# EasyEDA schematic SCH_DFM PCB_2023-04-27.json
TITLE: Distrubuted Fence Monitor; REV: 5.0; Date: 2023-3-20; Sheet: 1/1; Drawn By: B BRAITHWAITE; Company: ERAU ICARUS DFM CAPSTONE
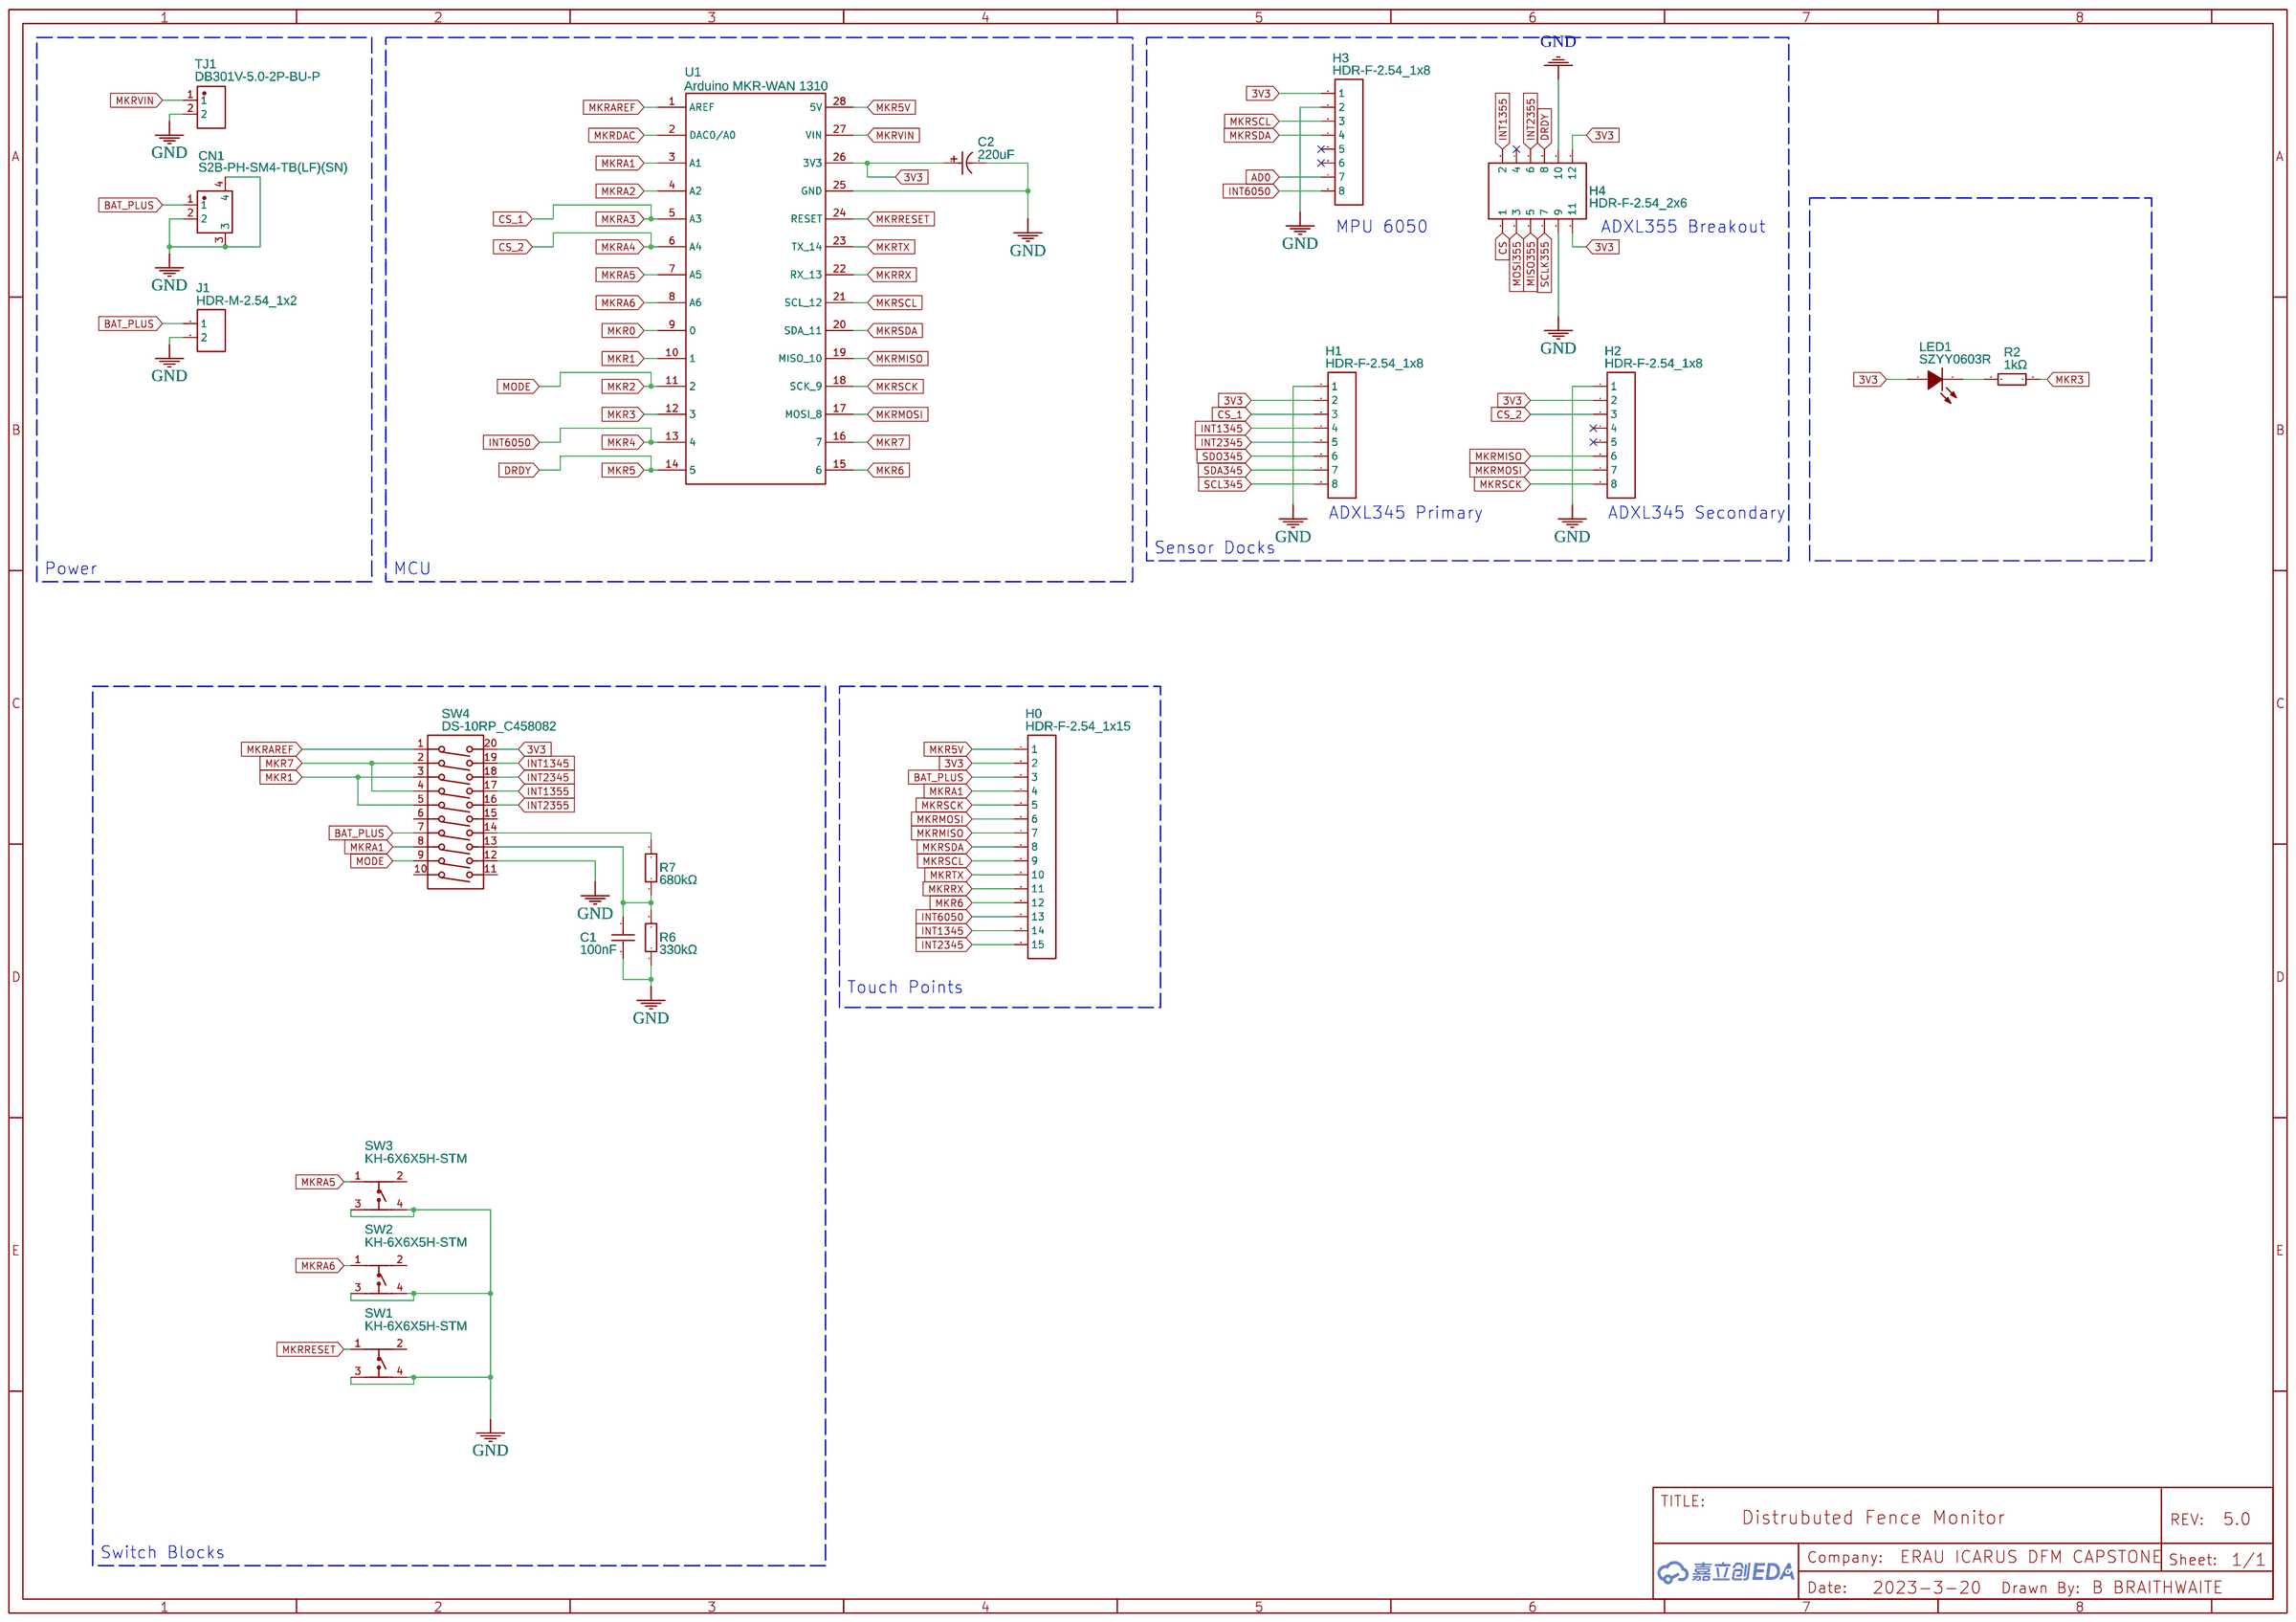
[diagram p0: schematic sheet]

## Parts
C1  100nF  [C0603]
C2  220uF  [CAP-SMD_BD6.3-L6.6-W6.6-FD]
CN1  S2B-PH-SM4-TB(LF)(SN)  [CONN-SMD_P2.00_S2B-PH-SM4-TB-LF-SN]
H0  HDR-F-2.54_1x15  [HDR-F-2.54_1X15]
H1  HDR-F-2.54_1x8  [HDR-F-2.54_1X8]
H2  HDR-F-2.54_1x8  [HDR-F-2.54_1X8]
H3  HDR-F-2.54_1x8  [HDR-F-2.54_1X8]
H4  HDR-F-2.54_2x6  [HDR-F-2.54_2X6]
J1  HDR-M-2.54_1x2  [HDR-M-2.54_1X2]
LED1  SZYY0603R  [LED0603-R-RD]
R2  1kΩ  [R0805]
R6  330kΩ  [R0805]
R7  680kΩ  [R0805]
SW1  KH-6X6X5H-STM  [SW-SMD_4P-L6.0-W6.0-P4.50-LS9.0-2]
SW2  KH-6X6X5H-STM  [SW-SMD_4P-L6.0-W6.0-P4.50-LS9.0-2]
SW3  KH-6X6X5H-STM  [SW-SMD_4P-L6.0-W6.0-P4.50-LS9.0-2]
SW4  DS-10RP_C458082  [SW-TH_DS-10RP]
TJ1  DB301V-5.0-2P-BU-P  [CONN-TH_2P-P5.00_DB301V-5.0-2P-BU-P]
U1  Arduino MKR-WAN 1310  [ARDUINO MKR1310]

## Library data of the parts
C1 = 0603B104K500NT: Supplier: LCSC; Manufacturer: FH(风华); Supplier Part: C30926; JLCPCB Part Class: Extended Part
C2 = RVT1A221M0605-C72494: Supplier: LCSC; Manufacturer: ROQANG(容强); Manufacturer Part: RVT1A221M0605; Supplier Part: C72494; JLCPCB Part Class: Extended Part
CN1 = S2B-PH-SM4-TB(LF)(SN): Supplier: LCSC; Supplier Part: C295747; Manufacturer: JST; Contributor: LCSC; JLCPCB Part Class: Extended Part
H0 = HDR-F-2.54_1x15: Supplier Part: C124408; Supplier: LCSC; Contributor: LCEDA_Lib
H1-H3 = HDR-F-2.54_1x8: Supplier Part: C225505; Supplier: LCSC; Contributor: LCEDA_Lib
H4 = HDR-F-2.54_2x6: Supplier Part: C36191; Supplier: LCSC; Contributor: LCEDA_Lib
J1 = HDR-M-2.54_1x2: Supplier Part: C124375; Supplier: LCSC; Contributor: LCEDA_Lib
LED1 = SZYY0603R: Supplier: LCSC; Supplier Part: C434419; Manufacturer: yongyu(永裕光电); Contributor: LCSC; JLCPCB Part Class: Extended Part
R2 = 0805W8F1001T5E: Supplier: LCSC; Manufacturer: UNI-ROYAL(厚声); Supplier Part: C17513; Resistance (Ohms): 1K; JLCPCB Part Class: Basic Part
R6 = 0805W8F3303T5E: Supplier: LCSC; Manufacturer: UNI-ROYAL(厚声); Supplier Part: C17629; Resistance (Ohms): 330K; JLCPCB Part Class: Basic Part
R7 = 0805W8F6803T5E: Supplier: LCSC; Manufacturer: UNI-ROYAL(厚声); Supplier Part: C17797; Resistance (Ohms): 680K; JLCPCB Part Class: Basic Part
SW1-SW3 = KH-6X6X5H-STM: Supplier: LCSC; Supplier Part: C2837531; Manufacturer: kinghelm(金航标); Contributor: LCSC; JLCPCB Part Class: Extended Part
SW4 = DS-10RP_C458082: Supplier: LCSC; Supplier Part: C458082; Manufacturer: 韩国韩荣; Manufacturer Part: DS-10RP; Contributor: LCSC; JLCPCB Part Class: Extended Part
TJ1 = DB301V-5.0-2P-BU-P: Supplier: LCSC; Supplier Part: C430621; Manufacturer: DIBO; Contributor: LCSC; JLCPCB Part Class: Extended Part
U1 = Arduino MKR-WAN 1310: Manufacturer Part: Arduino MKR GSM 1400; link: https://store.arduino.cc/mkr-wan-1310; Contributor: rafaellabastos

## Nets
3V3: C2.1 H0.2 H1.2 H2.2 H3.1 H4.11 H4.12 LED1.1(+) SW4.20 U1.26(3V3)
GND: C1.1 C2.2 CN1.2 CN1.3 CN1.4 H1.1 H2.1 H3.2 H4.9 H4.10 J1.2 R6.1 SW1.3 SW1.4 SW2.3 SW2.4 SW3.3 SW3.4 SW4.12 TJ1.2 U1.25(GND)
AD0: H3.7
BAT_PLUS: CN1.1 H0.3 J1.1 SW4.7
CS: H4.1
CS_1: H1.3 U1.5(A3)
CS_2: H2.3 U1.6(A4)
DRDY: H4.8 U1.14(5)
INT1345: H0.14 H1.4 SW4.19
INT1355: H4.2 SW4.17
INT2345: H0.15 H1.5 SW4.18
INT2355: H4.6 SW4.16
INT6050: H0.13 H3.8 U1.13(4)
MISO355: H4.5
MKR0: U1.9(0)
MKR1: SW4.3 SW4.5 U1.10(1)
MKR2: SW4.9 U1.11(2)
MKR3: R2.2 U1.12(3)
MKR5V: H0.1 U1.28(5V)
MKR6: H0.12 U1.15(6)
MKR7: SW4.2 SW4.4 U1.16(7)
MKRA1: H0.4 SW4.8 U1.3(A1)
MKRA2: U1.4(A2)
MKRA5: SW3.1 U1.7(A5)
MKRA6: SW2.1 U1.8(A6)
MKRAREF: SW4.1 U1.1(AREF)
MKRDAC: U1.2(DAC0/A0)
MKRMISO: H0.7 H2.6 U1.19(MISO 10)
MKRMOSI: H0.6 H2.7 U1.17(MOSI 8)
MKRRESET: SW1.1 U1.24(RESET)
MKRRX: H0.11 U1.22(RX 13)
MKRSCK: H0.5 H2.8 U1.18(SCK 9)
MKRSCL: H0.9 H3.3 U1.21(SCL 12)
MKRSDA: H0.8 H3.4 U1.20(SDA 11)
MKRTX: H0.10 U1.23(TX 14)
MKRVIN: TJ1.1 U1.27(VIN)
MOSI355: H4.3
SCL345: H1.8
SCLK355: H4.7
SDA345: H1.7
SDO345: H1.6
Net-(C1-2): C1.2 R6.2 R7.1 SW4.13
Net-(LED1-2): LED1.2(-) R2.1
Net-(R7-2): R7.2 SW4.14

Not connected (* = marked no-connect by the designer): H2 4* 5*; H3 5* 6*; H4 4*; SW1 2; SW2 2; SW3 2; SW4 6 10 11 15

## Notes on the sheet
- MPU 6050
- ADXL355 Breakout
- ADXL345 Primary
- ADXL345 Secondary
- Sensor Docks
- Power
- MCU
- Touch Points
- Switch Blocks
